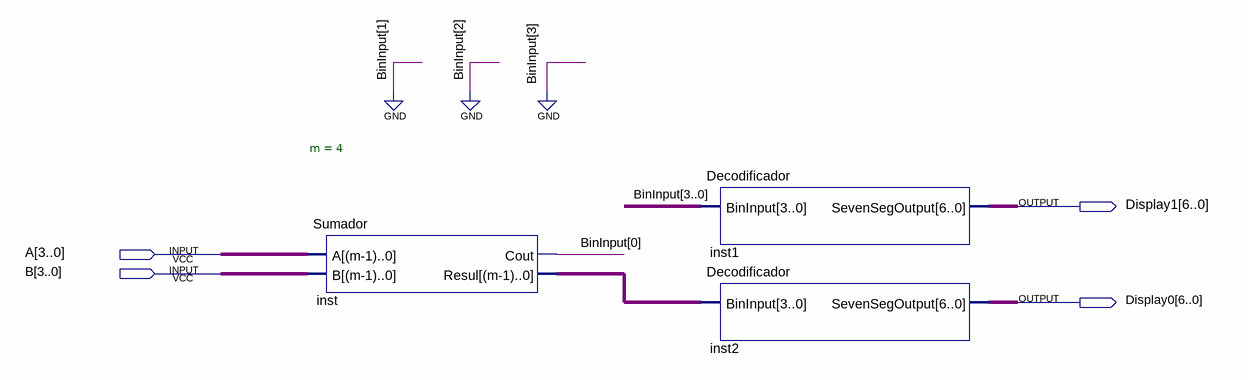
[diagram p0: schematic sheet]
// Quartus schematic SumadorCompleto.bdf as structural Verilog: 3 symbols, 4 pins
module SumadorCompleto (
  input  [3:0] A,
  input  [3:0] B,
  output [6:0] Display1,
  output [6:0] Display0
);

  wire [0:0] BinInput;
  wire [3:0] inst_resul;

  Sumador #(.m(4)) inst (.A(A), .B(B), .Cout(BinInput[0]), .Resul(inst_resul));
  Decodificador inst1 (.BinInput({3'b000, BinInput[0]}), .SevenSegOutput(Display1));
  Decodificador inst2 (.BinInput(inst_resul), .SevenSegOutput(Display0));
endmodule
